# EAGLE design 5V Boost Converter (EAGLE 9.6.2)
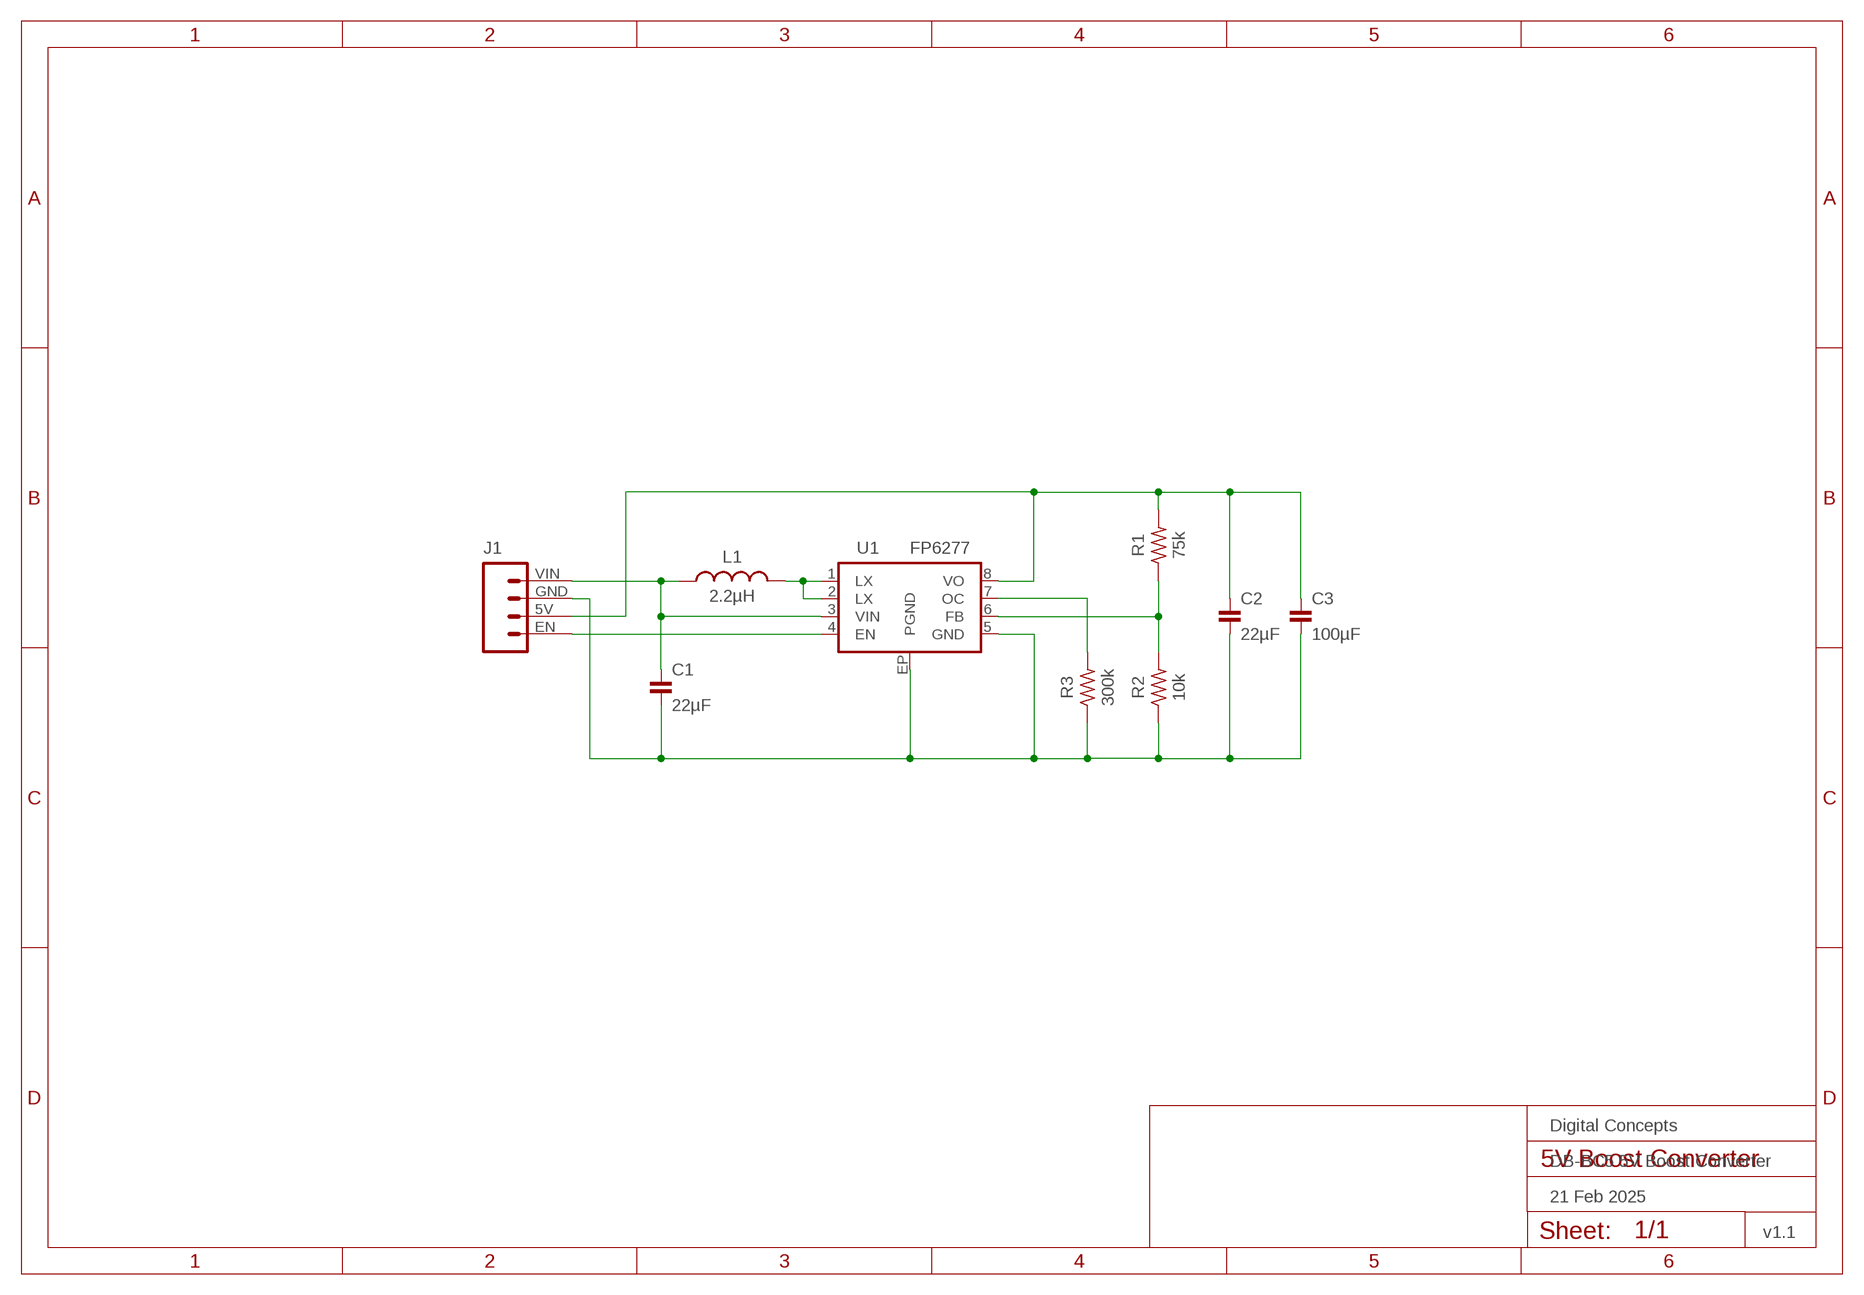
[diagram p0: schematic, sheet 1]
FRAME2 (FRAME-A4L-LOC): DATE: 21 Feb 2025; OWNER: Digital Concepts; TITLE: DB-BC5 5V Boost Converter; VERSION: v1.1

## Parts
C1  22µF  CAPACITOR-0805  [C0805]
C2  22µF  CAPACITOR-0805  [C0805]
C3  100µF  CAPACITOR-1206  [C1206]
J1  HEADER-1X4-FP6277  [CONN_04-FP6277]
L1  2.2µH  INDUCTOR-LQM2HPN2R2MG0L  [L1008]
R1  75k  RESISTORR0805  [R0805]
R2  10k  RESISTORR0805  [R0805]
R3  300k  RESISTORR0805  [R0805]
U1  FP6277  [SOP-8(EP)]

## Nets
5V: C2.1 C3.1 J1.5V R1.2 U1.8(VO)
EN: J1.EN U1.4(EN)
GND: C1.2 C2.2 C3.2 J1.GND R2.1 R3.1 U1.5(GND) U1.EP(PGND)
N$2: L1.P$1 U1.1(LX) U1.2(LX)
N$3: R1.1 R2.2 U1.6(FB)
N$5: R3.2 U1.7(OC)
VIN: C1.1 J1.VIN L1.P$2 U1.3(VIN)

## Library data of the parts
C1 C2 = digitalconcepts:CAPACITOR-0805: 0805 Capacitor
C3 = digitalconcepts:CAPACITOR-1206: 1206 Capacitor
J1 = digitalconcepts:HEADER-1X4-FP6277: FP6277 4-Pin Header
L1 = digitalconcepts:INDUCTOR-LQM2HPN2R2MG0L: LQM2HPN2R2MG0L Inductor
R1-R3 = digitalconcepts:RESISTOR: Resistor; SPICEPREFIX: R
U1 = digitalconcepts:FP6277: FP6277 Boost Controller

## Board
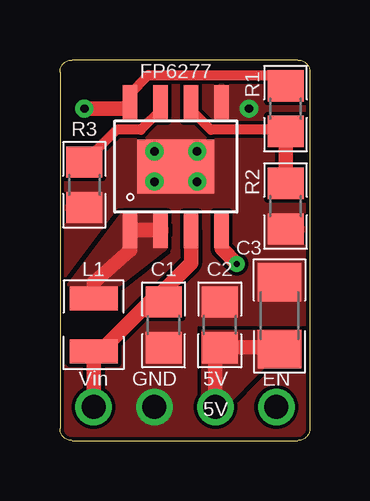
[diagram p1: board, top side]
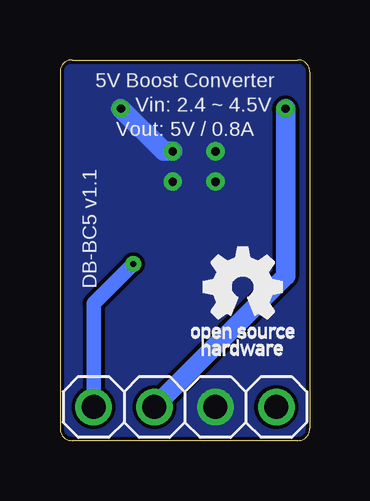
[diagram p2: board, bottom side, seen from below]

Size 10.41 x 15.88 mm. Coordinates in mm from the lower left corner, seen from the top.
Outline: 9.91,15.88 arc-90 10.41,15.37 10.41,0.51 arc-90 9.91,0 0.51,0 arc-90 0,0.51 0,15.37 arc-90 0.51,15.88 9.91,15.88
Copper layers (1*16): Top 0.035mm / dielectric 1.5mm / Bottom 0.035mm
Design rules "default *": minimum track width 6mil, minimum drill 0.15mm, track to track 6mil, track to pad 6mil, pad to pad 6mil, via to via 6mil, smd to smd 6mil, copper to edge 6mil, drill to drill 6mil, minimum pad ring 10mil, minimum via ring 8mil, stop-mask expansion 4mil, vias tented up to drill 0mil, thermal gap 0mil

### Footprints (pad centres in the part's own frame; a part is rotated, then mirrored left to right if it is on the bottom)
C0805 = smd 1.3 x 1.5: 1 -0.95,0; 2 0.95,0
C1206 = smd 1.6 x 1.8: 1 -1.4,0; 2 1.4,0
CONN_04-FP6277 = drill 1 pad 1.524: 5V 2.54,0; EN 0,0; GND 5.08,0; VIN 7.62,0
L1008 = smd 1 x 2: P$1 -1.1,0; P$2 1.1,0
R0805 = smd 1.3 x 1.5: 1 -0.95,0; 2 0.95,0
SOP-8(EP) = smd 0.6 x 1.5: 1 -1.905,-2.64; 2 -0.635,-2.64; 3 0.635,-2.64; 4 1.905,-2.64; 5 1.905,2.64; 6 0.635,2.64; 7 -0.635,2.64; 8 -1.905,2.64 | smd 3.2 x 2.26: EP 0,0

### Placement (x,y rotation side)
C1  4.32,4.83 270 top
C2  6.65,4.83 90 top
C3  9.14,5.21 90 top
J1  9.02,1.4 0 bottom
L1  1.4,4.83 270 top
R1  9.4,13.84 90 top
R2  9.4,9.78 90 top
R3  1.02,10.67 90 top
U1  4.83,11.43 0 top

### Tracks (layer width: path | path; a pad name or v marks a point on that pad's centre or on a via)
5V  (via drill 0.35)
  Top 0.406: U1.8 2.92,14.48 3.68,15.24 9.4,15.24 R1.2 | C3.1 9.13,3.88
  Top 0.61: 9.13,3.88 C2.1 6.48,3.75 J1.5V | U1.8 2.69,13.84 v1.02,13.84
  Bottom 0.813: v1.02,13.84 1.02,6.86 J1.5V
  pour Top (no thermals): 5.92,4.6 10.03,4.6 10.03,3.02 8.48,3.02 6.73,1.27 6.25,1.27 5.92,1.49
EN  (via drill 0.25 pad 0.65)
  Top 0.61: v7.37,7.37 6.73,8 U1.4
  Bottom 0.61: v7.37,7.37 9.02,5.71 J1.EN
GND  (via drill 0.35)
  Bottom 0.813: v7.87,13.84 6.1,12.06 v5.71,12.06
  other vias: 3.94,12.06 5.71,10.79 3.94,10.79
  pour Top (rank 5): -0.51,16.38 10.92,16.38 10.92,-0.51 -0.51,-0.51
  pour Bottom: -0.25,16.13 10.67,16.13 10.67,-0.25 -0.25,-0.25
N$2
  Top 0.61: U1.2 U1.1 2.92,7.94 1.4,6.59 L1.P$1
  pour Top: 0.33,6.48 2.62,9.53 4.5,9.53 4.5,8.03 2.49,6.48
N$3
  Top 0.406: U1.6 5.46,13.79 6.28,12.96 9.39,12.96 R1.1
  Top 0.61: R1.1 R2.2
N$5
  Top 0.406: R3.2 2.36,12.96 3.37,12.96 4.19,13.79 U1.7
VIN
  Top 0.61: U1.3 5.46,7.4 4.32,6.26 C1.1 3.75,5.78 1.5,3.53 L1.P$2 J1.VIN

### Text on the board
bPlace: 5V Boost Converter | Vin: 2.4 ~ 4.5V | Vout: 5V / 0.8A | DB-BC5 v1.1
tNames: Vin | GND | 5V | EN | 5V